# EasyEDA schematic LcsNodes-Extension-BreadBoard-B.00.01.json
TITLE: LcsNodes - Extension Breadboard; REV: B.01.00; Date: 2023-08-19; Sheet: 1/1; Drawn By: helmut-f; Company: Your Company
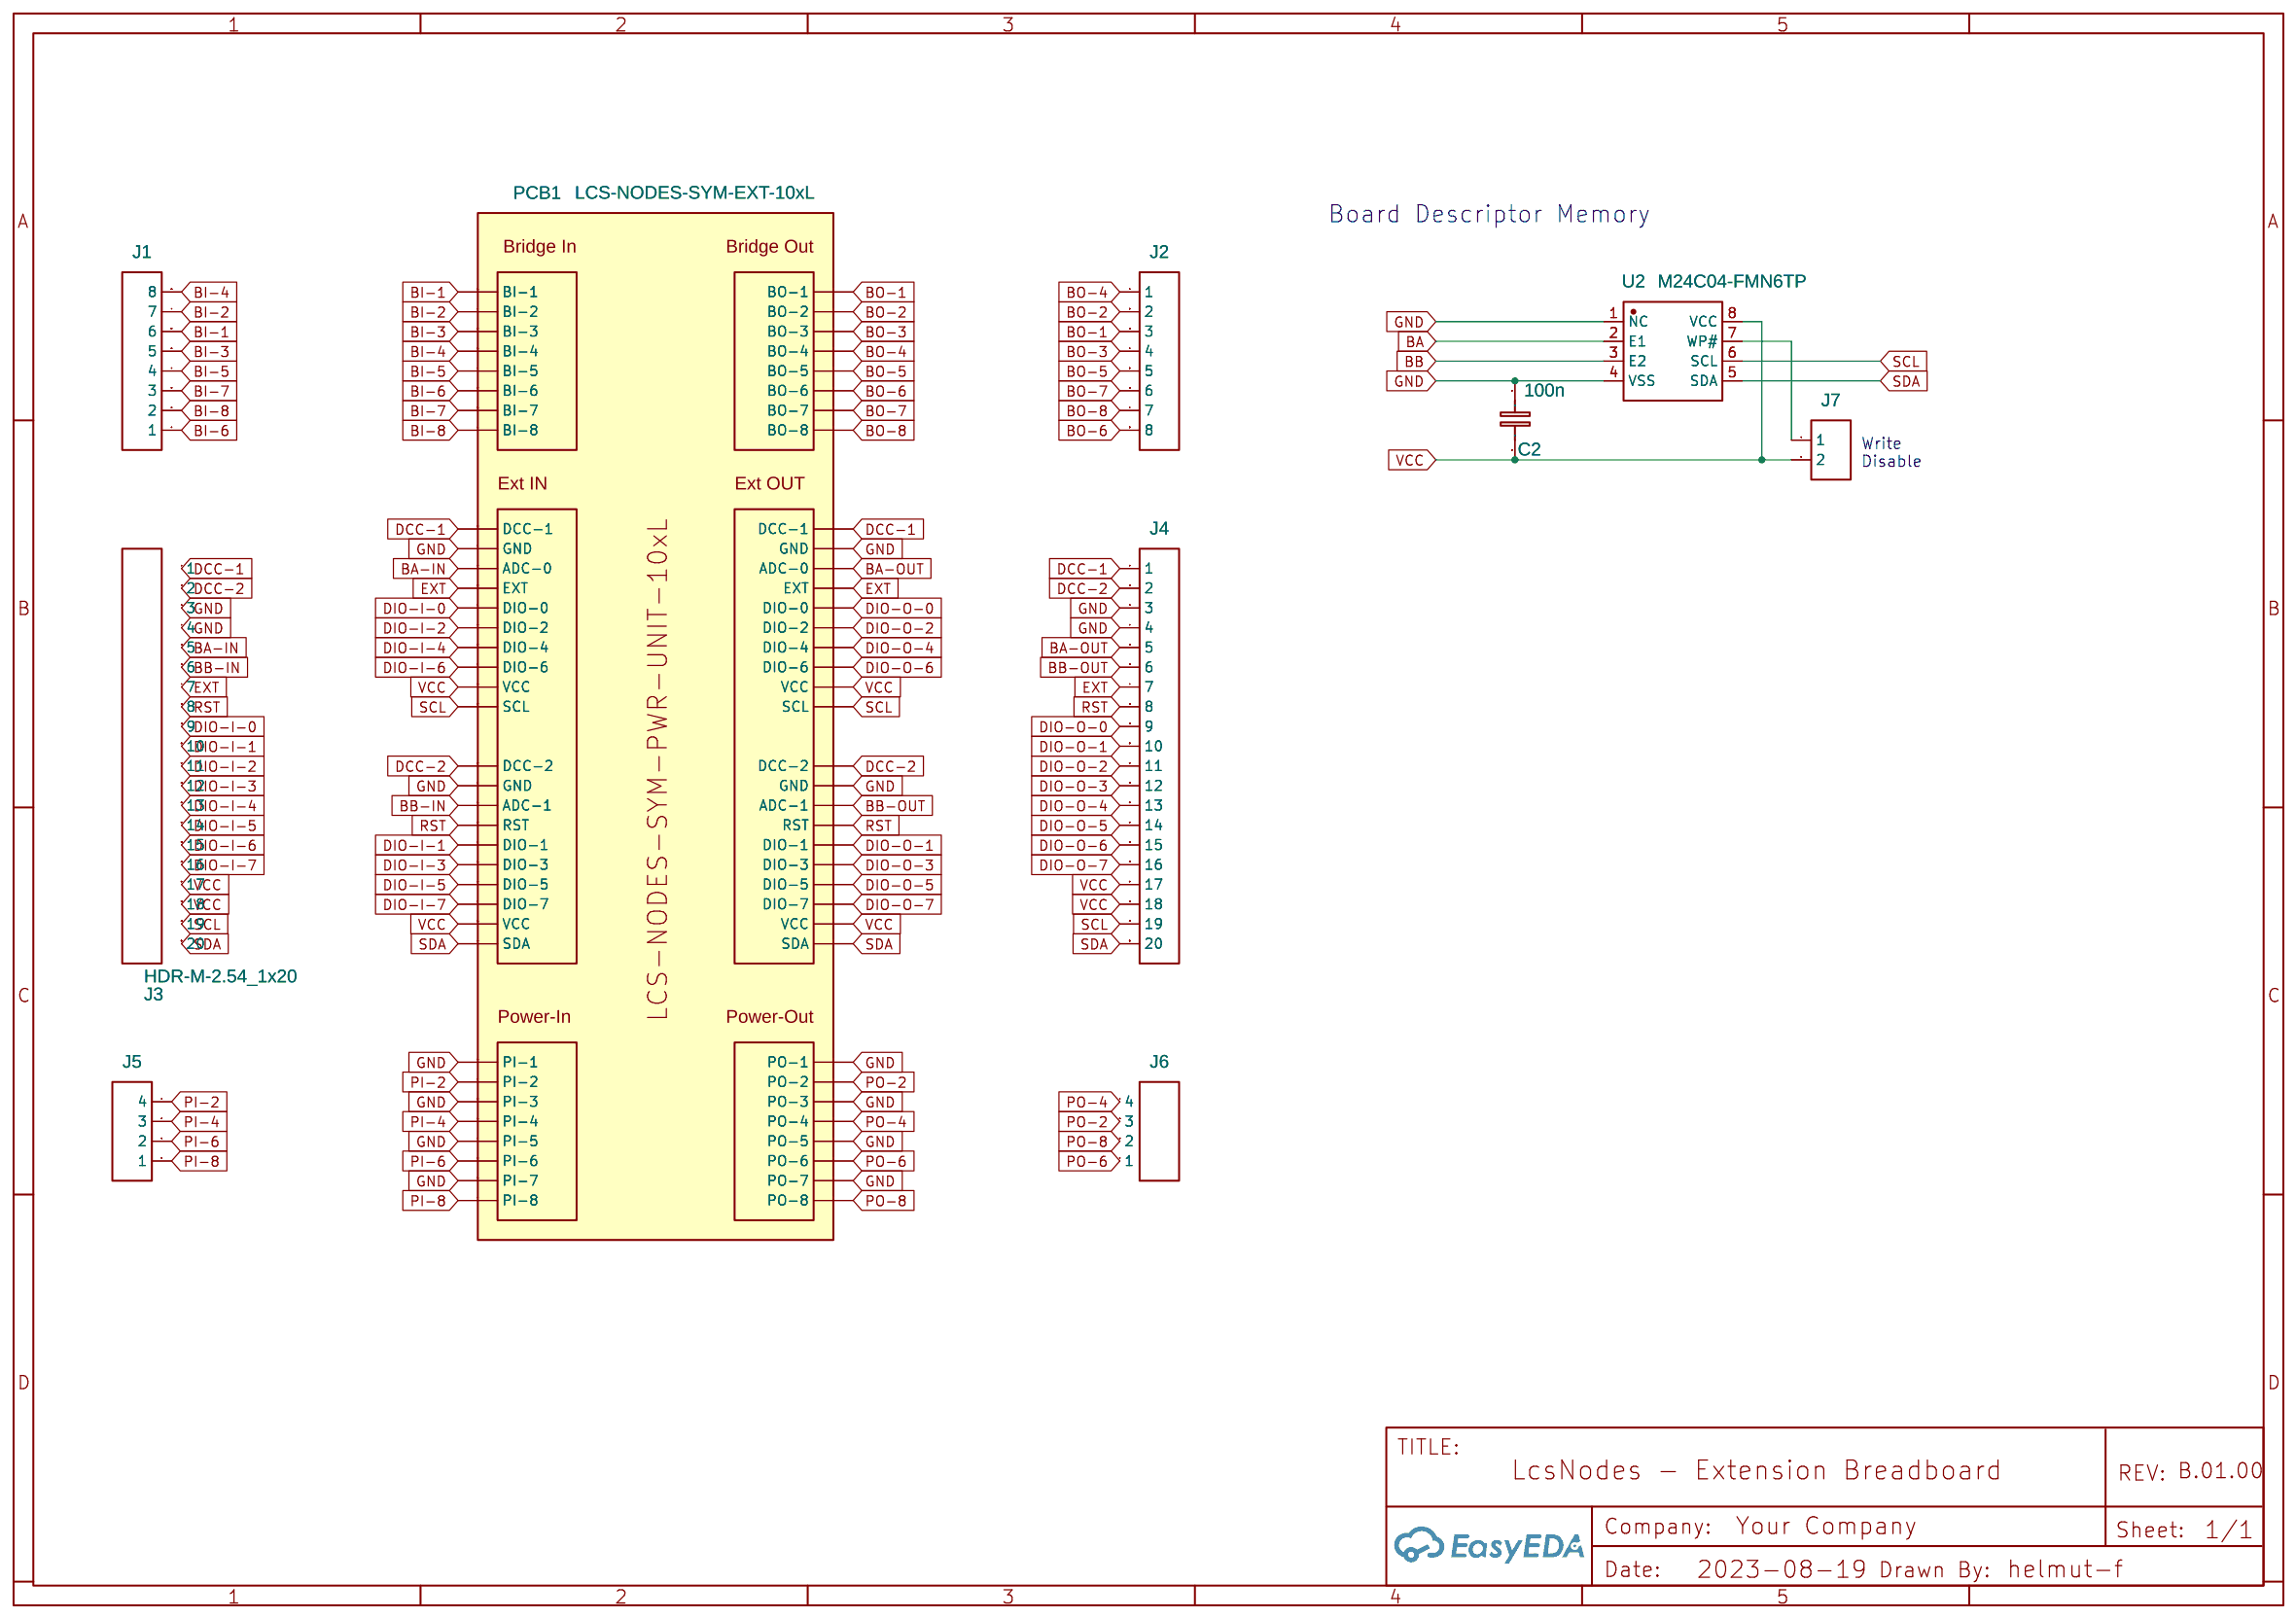
[diagram p0: schematic sheet]

## Parts
C2  100n  [C1206]
J1  HDR-M-2.54_1x8  [HDR-M-2.54_1X8]
J2  HDR-M-2.54_1x8  [HDR-M-2.54_1X8]
J3  HDR-M-2.54_1x20  [HDR-M-2.54_1X20]
J4  HDR-M-2.54_1x20  [HDR-M-2.54_1X20]
J5  HDR-M-2.54_1x4  [HDR-M-2.54_1X4]
J6  HDR-M-2.54_1x4  [HDR-M-2.54_1X4]
J7  HDR-M-2.54_1x2  [HDR-M-2.54_1X2]
PCB1  LCS-NODES-SYM-EXT-10xL  [LCS-NODES-FP-EXT-PCB-10X12]
U2  M24C04-FMN6TP  [SOP-8_L5.0-W3.9-P1.27-LS6.0-BL]

## Library data of the parts
C2 = C_0603_EU: Contributor: LCEDA_Lib; Package Display: No
J1 J2 = HDR-M-2.54_1x8: Supplier Part: C190820; Supplier: LCSC; Contributor: LCEDA_Lib
J3 J4 = HDR-M-2.54_1x20: Supplier Part: C50981; Supplier: LCSC; Contributor: LCEDA_Lib
J5 J6 = HDR-M-2.54_1x4: Supplier Part: C124378; Supplier: LCSC; Contributor: LCEDA_Lib
J7 = HDR-M-2.54_1x2: Supplier Part: C124375; Supplier: LCSC; Contributor: LCEDA_Lib
PCB1 = LCS-NODES-SYM-EXT-10X8: Contributor: helmut-f; Package Display: No
U2 = M24C04-FMN6TP: Supplier: LCSC; Supplier Part: C2062025; Manufacturer: ST(意法半导体); Contributor: LCSC; JLCPCB Part Class: Extended Part

## Nets
GND: C2.1 J3.3 J3.4 J4.3 J4.4 PCB1.21(GND) PCB1.31(GND) PCB1.40(PI-1) PCB1.42(PI-3) PCB1.44(PI-5) PCB1.46(PI-7) PCB1.61(GND) PCB1.71(GND) PCB1.80(PO-1) PCB1.82(PO-3) PCB1.84(PO-5) PCB1.86(PO-7) U2.1(NC) U2.4(VSS)
VCC: C2.2 J3.17 J3.18 J4.17 J4.18 J7.2 PCB1.28(VCC) PCB1.38(VCC) PCB1.68(VCC) PCB1.78(VCC) U2.8(VCC)
BA: U2.2(E1)
BA-IN: J3.5 PCB1.22(ADC-0)
BA-OUT: J4.5 PCB1.62(ADC-0)
BB: U2.3(E2)
BB-IN: J3.6 PCB1.32(ADC-1)
BB-OUT: J4.6 PCB1.72(ADC-1)
BI-1: J1.6 PCB1.10(BI-1)
BI-2: J1.7 PCB1.11(BI-2)
BI-3: J1.5 PCB1.12(BI-3)
BI-4: J1.8 PCB1.13(BI-4)
BI-5: J1.4 PCB1.14(BI-5)
BI-6: J1.1 PCB1.15(BI-6)
BI-7: J1.3 PCB1.16(BI-7)
BI-8: J1.2 PCB1.17(BI-8)
BO-1: J2.3 PCB1.50(BO-1)
BO-2: J2.2 PCB1.51(BO-2)
BO-3: J2.4 PCB1.52(BO-3)
BO-4: J2.1 PCB1.53(BO-4)
BO-5: J2.5 PCB1.54(BO-5)
BO-6: J2.8 PCB1.55(BO-6)
BO-7: J2.6 PCB1.56(BO-7)
BO-8: J2.7 PCB1.57(BO-8)
DCC-1: J3.1 J4.1 PCB1.20(DCC-1) PCB1.60(DCC-1)
DCC-2: J3.2 J4.2 PCB1.30(DCC-2) PCB1.70(DCC-2)
DIO-I-0: J3.9 PCB1.24(DIO-0)
DIO-I-1: J3.10 PCB1.34(DIO-1)
DIO-I-2: J3.11 PCB1.25(DIO-2)
DIO-I-3: J3.12 PCB1.35(DIO-3)
DIO-I-4: J3.13 PCB1.26(DIO-4)
DIO-I-5: J3.14 PCB1.36(DIO-5)
DIO-I-6: J3.15 PCB1.27(DIO-6)
DIO-I-7: J3.16 PCB1.37(DIO-7)
DIO-O-0: J4.9 PCB1.64(DIO-0)
DIO-O-1: J4.10 PCB1.74(DIO-1)
DIO-O-2: J4.11 PCB1.65(DIO-2)
DIO-O-3: J4.12 PCB1.75(DIO-3)
DIO-O-4: J4.13 PCB1.66(DIO-4)
DIO-O-5: J4.14 PCB1.76(DIO-5)
DIO-O-6: J4.15 PCB1.67(DIO-6)
DIO-O-7: J4.16 PCB1.77(DIO-7)
EXT: J3.7 J4.7 PCB1.23(EXT) PCB1.63(EXT)
PI-2: J5.4 PCB1.41(PI-2)
PI-4: J5.3 PCB1.43(PI-4)
PI-6: J5.2 PCB1.45(PI-6)
PI-8: J5.1 PCB1.47(PI-8)
PO-2: J6.3 PCB1.81(PO-2)
PO-4: J6.4 PCB1.83(PO-4)
PO-6: J6.1 PCB1.85(PO-6)
PO-8: J6.2 PCB1.87(PO-8)
RST: J3.8 J4.8 PCB1.33(RST) PCB1.73(RST)
SCL: J3.19 J4.19 PCB1.29(SCL) PCB1.69(SCL) U2.6(SCL)
SDA: J3.20 J4.20 PCB1.39(SDA) PCB1.79(SDA) U2.5(SDA)
Net-(J7-1): J7.1 U2.7(WP#)

## Notes on the sheet
- Board Descriptor Memory
- Write
  Disable
